# Altium schematic sheet NBT_I2C_INT.SCHDOC
size A4; Organization: Altium Limited; Address1: L3, 12a Rodborough Rd; Address2: Frenchs Forest; Address3: NSW; Address4: Australia 2086; DocumentNumber: 9; SheetNumber: 9; SheetTotal: 12
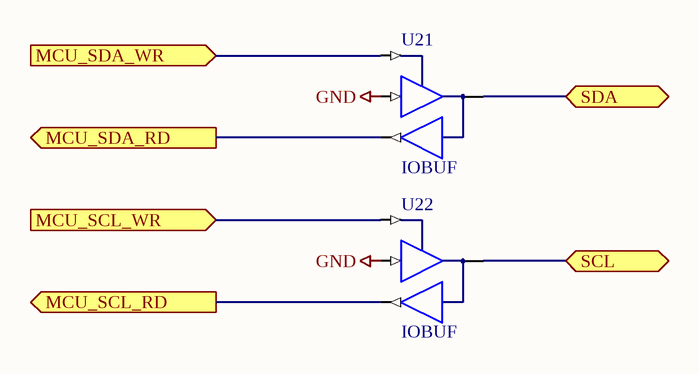
[diagram p0: NBT_I2C_INT.SCHDOC]

## Parts
U21  IOBUF
U22  IOBUF

## Ports
MCU_SCL_RD (out), MCU_SCL_WR (in), MCU_SDA_RD (out), MCU_SDA_WR (in), SCL (bidir), SDA (bidir)

## Nets
GND: U21.I U22.I
MCU_SCL_RD: U22.O ; port MCU_SCL_RD
MCU_SCL_WR: U22.T ; port MCU_SCL_WR
MCU_SDA_RD: U21.O ; port MCU_SDA_RD
MCU_SDA_WR: U21.T ; port MCU_SDA_WR
SCL: U22.IO ; port SCL
SDA: U21.IO ; port SDA

## Notes on the sheet
- Title
- Size:
- Date:
- A4
- Number:
- Time:
- Revision:
- Sheet
- of
- File:

## Library data of the parts
U21 U22 = IOBUF: Input/Output Buffer; ArchiveName: GENERIC; Published: 7-Nov-2003; Publisher: Altium Limited; Xilinx Equivalent: IOBUF; Core Revision: 1.00.00